# Altium schematic sheet RJ45-1.SchDoc
size A4
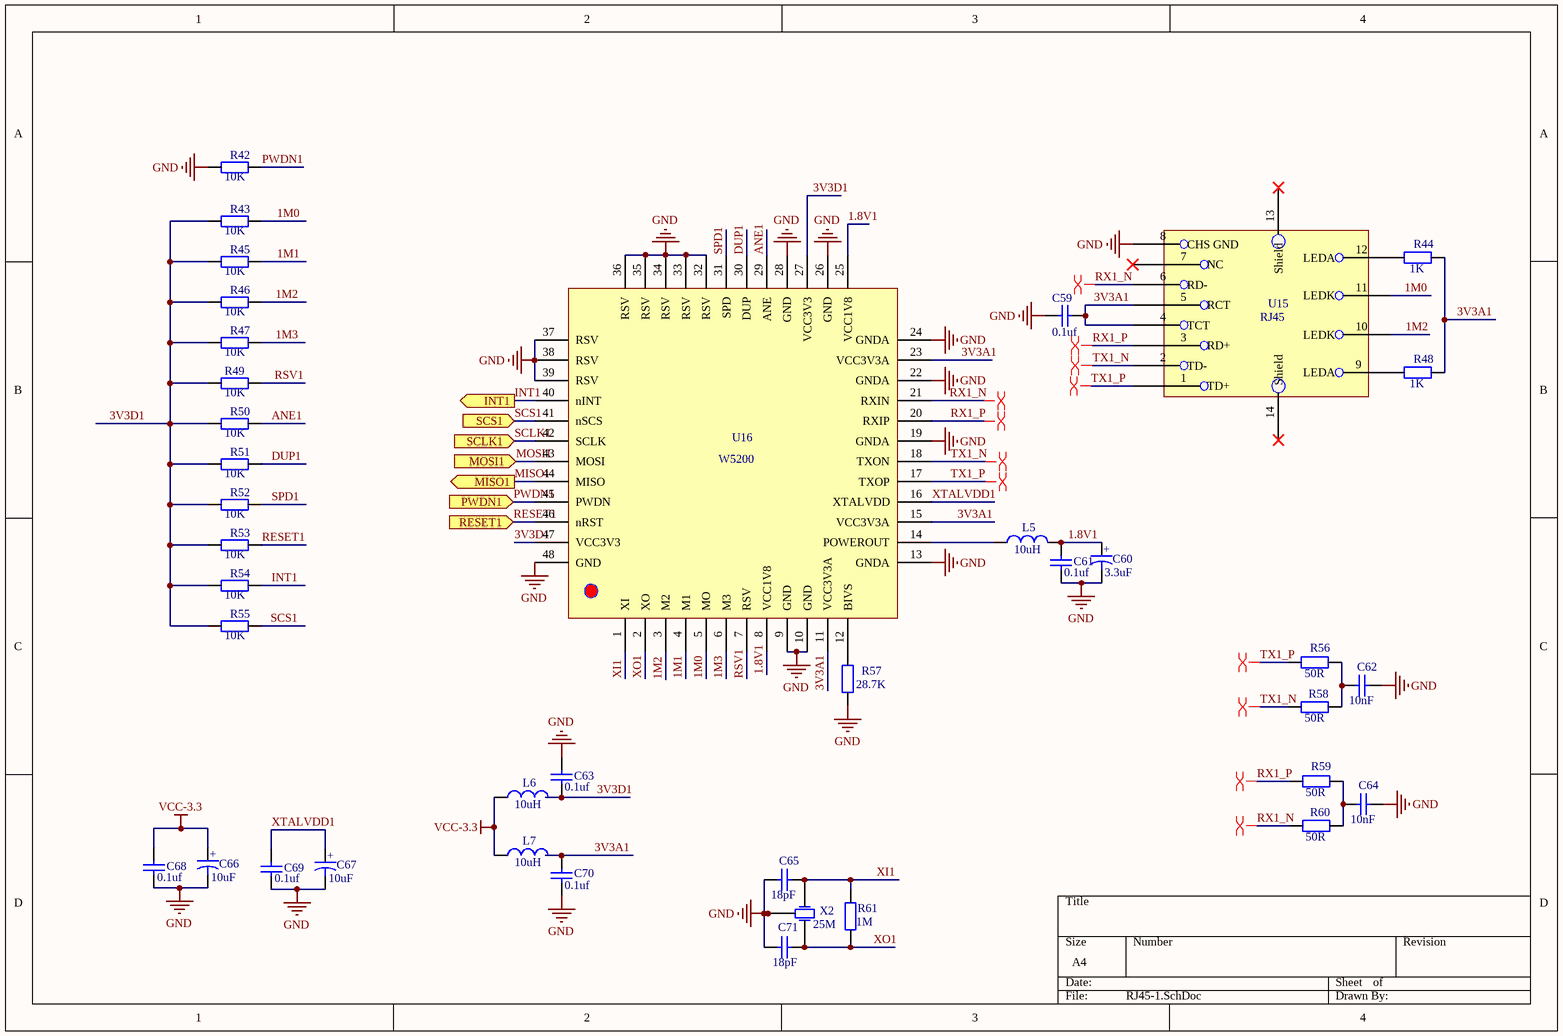
[diagram p0: RJ45-1.SchDoc]

## Parts
C59  value 0.1uf  [0603]  (hidden comment: Capacitor-0603)
C60  value 3.3uF  [钽电容1206（A3216）]  (hidden comment: 电解电容)
C61  value 0.1uf  [0603]  (hidden comment: Capacitor-0603)
C62  value 10nF  [0603]  (hidden comment: Capacitor-0603)
C63  value 0.1uf  [0603]  (hidden comment: Capacitor-0603)
C64  value 10nF  [0603]  (hidden comment: Capacitor-0603)
C65  value 18pF  [0603]  (hidden comment: Capacitor-0603)
C66  value 10uF  [钽电容1206（A3216）]  (hidden comment: 电解电容)
C67  value 10uF  [钽电容1206（A3216）]  (hidden comment: 电解电容)
C68  value 0.1uf  [0603]  (hidden comment: Capacitor-0603)
C69  value 0.1uf  [0603]  (hidden comment: Capacitor-0603)
C70  value 0.1uf  [0603]  (hidden comment: Capacitor-0603)
C71  value 18pF  [0603]  (hidden comment: Capacitor-0603)
L5  value 10uH  [0805]  (hidden comment: Inductor)
L6  value 10uH  [0805]  (hidden comment: Inductor)
L7  value 10uH  [0805]  (hidden comment: Inductor)
R42  value 10K  [0603]  (hidden comment: Resistor-0603)
R43  value 10K  [0603]  (hidden comment: Resistor-0603)
R44  value 1K  [0603]  (hidden comment: Resistor-0603)
R45  value 10K  [0603]  (hidden comment: Resistor-0603)
R46  value 10K  [0603]  (hidden comment: Resistor-0603)
R47  value 10K  [0603]  (hidden comment: Resistor-0603)
R48  value 1K  [0603]  (hidden comment: Resistor-0603)
R49  value 10K  [0603]  (hidden comment: Resistor-0603)
R50  value 10K  [0603]  (hidden comment: Resistor-0603)
R51  value 10K  [0603]  (hidden comment: Resistor-0603)
R52  value 10K  [0603]  (hidden comment: Resistor-0603)
R53  value 10K  [0603]  (hidden comment: Resistor-0603)
R54  value 10K  [0603]  (hidden comment: Resistor-0603)
R55  value 10K  [0603]  (hidden comment: Resistor-0603)
R56  value 50R  [0603]  (hidden comment: Resistor-0603)
R57  value 28.7K  [0603]  (hidden comment: Resistor-0603)
R58  value 50R  [0603]  (hidden comment: Resistor-0603)
R59  value 50R  [0603]  (hidden comment: Resistor-0603)
R60  value 50R  [0603]  (hidden comment: Resistor-0603)
R61  value 1M  [0603]  (hidden comment: Resistor-0603)
U15  RJ45  [RJ45]
U16  Name: W5200  [W5200-Chip]  (hidden comment: W5200-Chip)
X2  value 25M  [3225无源晶振]  (hidden comment: 3225无源晶振)

## Ports
INT1 (out), MISO1 (out), MOSI1 (in), PWDN1 (in), RESET1 (in), SCLK1 (in), SCS1 (in)

## Nets
GND: C59.2 C60.1 C61.1 C62.2 C63.2 C64.2 C65.1 C66.1 C67.1 C68.1 C69.1 C70.2 C71.1 R42.1 R57.1 U15.8(CHS_GND) U16.9(GND) U16.10(GND) U16.13(GNDA) U16.19(GNDA) U16.22(GNDA) U16.24(GNDA) U16.26(GND) U16.28(GND) U16.32(RSV) U16.33(RSV) U16.34(RSV) U16.35(RSV) U16.36(RSV) U16.37(RSV) U16.38(RSV) U16.39(RSV) U16.48(GND) X2.2(GND) X2.4(GND)
VCC-3.3: C66.2 C68.2 L6.1 L7.1
1.8V1: C60.2 C61.2 L5.2 U16.8(VCC1V8) U16.25(VCC1V8)
1M0: R43.2 U15.11(LEDK) U16.5(MO)
1M1: R45.2 U16.4(M1)
1M2: R46.2 U15.10(LEDK) U16.3(M2)
1M3: R47.2 U16.6(M3)
3V3A1: C59.1 C70.1 L7.2 R44.2 R48.2 U15.4(TCT) U15.5(RCT) U16.11(VCC3V3A) U16.15(VCC3V3A) U16.23(VCC3V3A)
3V3D1: C63.1 L6.2 R43.1 R45.1 R46.1 R47.1 R49.1 R50.1 R51.1 R52.1 R53.1 R54.1 R55.1 U16.27(VCC3V3) U16.47(VCC3V3)
ANE1: R50.2 U16.29(ANE)
DUP1: R51.2 U16.30(DUP)
INT1: R54.2 U16.40(nINT) ; port INT1
MISO1: U16.44(MISO) ; port MISO1
MOSI1: U16.43(MOSI) ; port MOSI1
PWDN1: R42.2 U16.45(PWDN) ; port PWDN1
RESET1: R53.2 U16.46(nRST) ; port RESET1
RSV1: R49.2 U16.7(RSV)
RX1_N: R60.1 U15.6(RD-) U16.21(RXIN)
RX1_P: R59.1 U15.3(RD+) U16.20(RXIP)
SCLK1: U16.42(SCLK) ; port SCLK1
SCS1: R55.2 U16.41(nSCS) ; port SCS1
SPD1: R52.2 U16.31(SPD)
TX1_N: R58.1 U15.2(TD-) U16.18(TXON)
TX1_P: R56.1 U15.1(TD+) U16.17(TXOP)
XI1: C65.2 R61.1 U16.1(XI) X2.1(OSC1)
XO1: C71.2 R61.2 U16.2(XO) X2.3(OSC2)
XTALVDD1: C67.2 C69.2 U16.16(XTALVDD)
NetC62_1: C62.1 R56.2 R58.2
NetC64_1: C64.1 R59.2 R60.2
NetL5_1: L5.1 U16.14(POWEROUT)
NetR44_1: R44.1 U15.12(LEDA)
NetR48_1: R48.1 U15.9(LEDA)
NetR57_2: R57.2 U16.12(BIVS)

Not connected (* = marked no-connect by the designer): U15 7(NC)* 13(Shield)* 14(Shield)*

## Layout directives
differential pair: RX1_N, RX1_P, TX1_N, TX1_P

## Notes on the sheet
- (in symbol 电解电容) +

## Library data of the parts
U15 = RJ45: Name: RJ45